# Altium schematic sheet frequency_output.schdoc
size A3; Organization: Altium Limited; Address1: L3, 12a Rodborough Rd; Address2: Frenchs Forest; Address3: NSW; Address4: Australia 2086
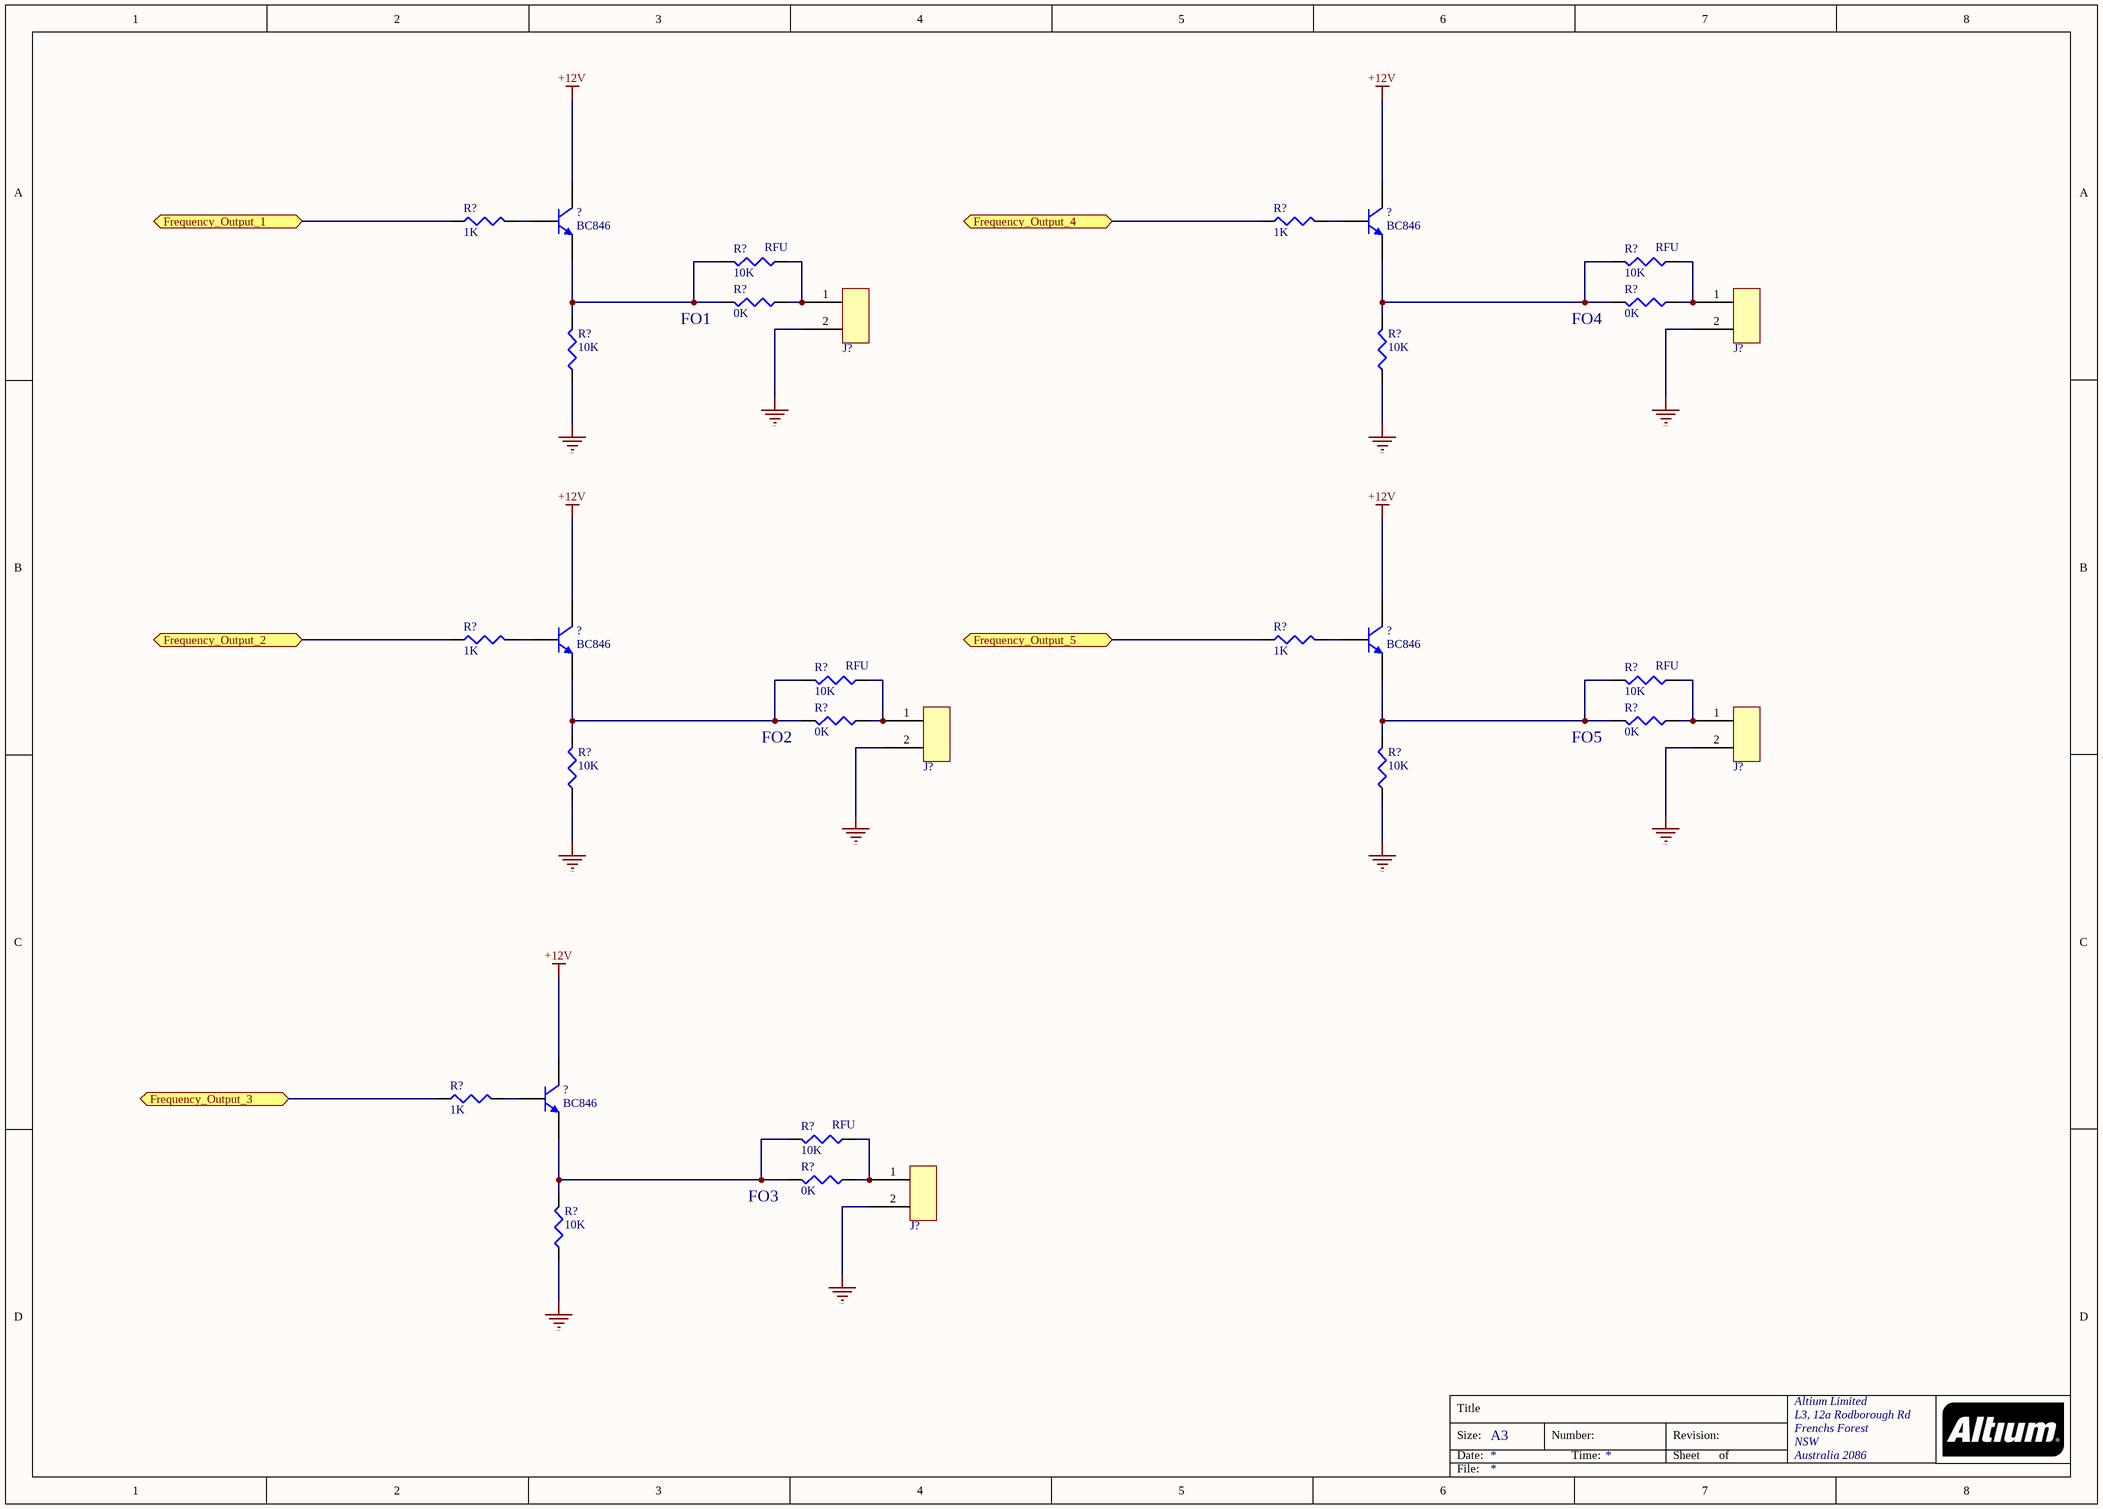
[diagram p0: frequency_output.schdoc]

## Parts
(Parts that share a designator on the sheet are numbered #1, #2 ... from top to bottom, then left to right.)
?#1  BC846  [SOT23]
?#2  BC846  [SOT23]
?#3  BC846  [SOT23]
?#4  BC846  [SOT23]
?#5  BC846  [SOT23]
J?#1  2x Terminal  [2x Terminal mini]  (value not drawn)
J?#2  2x Terminal  [2x Terminal mini]  (value not drawn)
J?#3  2x Terminal  [2x Terminal mini]  (value not drawn)
J?#4  2x Terminal  [2x Terminal mini]  (value not drawn)
J?#5  2x Terminal  [2x Terminal mini]  (value not drawn)
R?#1  value 1K  [0805 Resistor]  (hidden comment: 0805_1K)
R?#2  value 1K  [0805 Resistor]  (hidden comment: 0805_1K)
R?#3  value 10K  [0805 Resistor]  (hidden comment: 0805_10K)
R?#4  value 10K  [0805 Resistor]  (hidden comment: 0805_10K)
R?#5  value 0K  [0805 Resistor]  (hidden comment: 0805_10K)
R?#6  value 0K  [0805 Resistor]  (hidden comment: 0805_10K)
R?#7  value 10K  [0805 Resistor]  (hidden comment: 0805_10K)
R?#8  value 10K  [0805 Resistor]  (hidden comment: 0805_10K)
R?#9  value 1K  [0805 Resistor]  (hidden comment: 0805_1K)
R?#10  value 1K  [0805 Resistor]  (hidden comment: 0805_1K)
R?#11  value 10K  [0805 Resistor]  (hidden comment: 0805_10K)
R?#12  value 10K  [0805 Resistor]  (hidden comment: 0805_10K)
R?#13  value 0K  [0805 Resistor]  (hidden comment: 0805_10K)
R?#14  value 0K  [0805 Resistor]  (hidden comment: 0805_10K)
R?#15  value 10K  [0805 Resistor]  (hidden comment: 0805_10K)
R?#16  value 10K  [0805 Resistor]  (hidden comment: 0805_10K)
R?#17  value 1K  [0805 Resistor]  (hidden comment: 0805_1K)
R?#18  value 10K  [0805 Resistor]  (hidden comment: 0805_10K)
R?#19  value 0K  [0805 Resistor]  (hidden comment: 0805_10K)
R?#20  value 10K  [0805 Resistor]  (hidden comment: 0805_10K)

## Ports
Frequency_Output_1 (bidir), Frequency_Output_2 (bidir), Frequency_Output_3 (bidir), Frequency_Output_4 (bidir), Frequency_Output_5 (bidir)

## Nets
+12V: ?#1.3(C) ?#2.3(C) ?#3.3(C) ?#4.3(C) ?#5.3(C)
GND: J?#1.2 J?#2.2 J?#3.2 J?#4.2 J?#5.2 R?#7.1 R?#8.1 R?#15.1 R?#16.1 R?#20.1
Frequency_Output_1: R?#1.1 ; port Frequency_Output_1
Frequency_Output_2: R?#9.1 ; port Frequency_Output_2
Frequency_Output_3: R?#17.1 ; port Frequency_Output_3
Frequency_Output_4: R?#2.1 ; port Frequency_Output_4
Frequency_Output_5: R?#10.1 ; port Frequency_Output_5
Net?#1_1: ?#1.1(B) R?#1.2
Net?#1_2: ?#1.2(E) R?#3.2 R?#5.2 R?#7.2
Net?#2_1: ?#2.1(B) R?#2.2
Net?#2_2: ?#2.2(E) R?#4.2 R?#6.2 R?#8.2
Net?#3_1: ?#3.1(B) R?#9.2
Net?#3_2: ?#3.2(E) R?#11.2 R?#13.2 R?#15.2
Net?#4_1: ?#4.1(B) R?#10.2
Net?#4_2: ?#4.2(E) R?#12.2 R?#14.2 R?#16.2
Net?#5_1: ?#5.1(B) R?#17.2
Net?#5_2: ?#5.2(E) R?#18.2 R?#19.2 R?#20.2
NetJ?#1_1: J?#1.1 R?#3.1 R?#5.1
NetJ?#2_1: J?#2.1 R?#4.1 R?#6.1
NetJ?#3_1: J?#3.1 R?#11.1 R?#13.1
NetJ?#4_1: J?#4.1 R?#12.1 R?#14.1
NetJ?#5_1: J?#5.1 R?#18.1 R?#19.1

## Notes on the sheet
- (near R?#3) RFU
- (near R?#4) RFU
- (near R?#5) FO1
- (near R?#6) FO4
- (near R?#11) RFU
- (near R?#12) RFU
- (near R?#13) FO2
- (near R?#14) FO5
- (near R?#18) RFU
- (near R?#19) FO3
- Title
- Size:
- Date:
- A3
- Number:
- Time:
- Revision:
- Sheet
- of
- File:

## Library data of the parts
?#1-?#5 = BC846: Manufacturer: NXP Semiconductors; Voltage: 65V; Farnell Code: 1081227; Manufacturer Code: BC846; Unit Price: 0,049 €; Value: BC846
J?#1-J?#5 = 2x Terminal: Manufacturer: WEIDMULLER; Manufacturer Code: PM5.08/2/90 BLK; Value: 2x Terminal; Farnell Code: 1131855; Unit Price: 0,55 €
R?#1 R?#2 R?#9 R?#10 R?#17 = 0805_1K: Manufacturer Code: MC01W080511K; Manufacturer: MULTICOMP; Tolerance: ±1%; Farnell Code: 9332383; Unit Price: 0,03 €
R?#3-R?#8 R?#11-R?#16 R?#18-R?#20 = 0805_10K: Manufacturer Code: MC 0.1W 0805 1% 10K; Manufacturer: MULTICOMP; Tolerance: ±1%; Farnell Code: 9332391; Unit Price: 0,03 €